# EAGLE design open-lux-O (EAGLE 6.5.0)
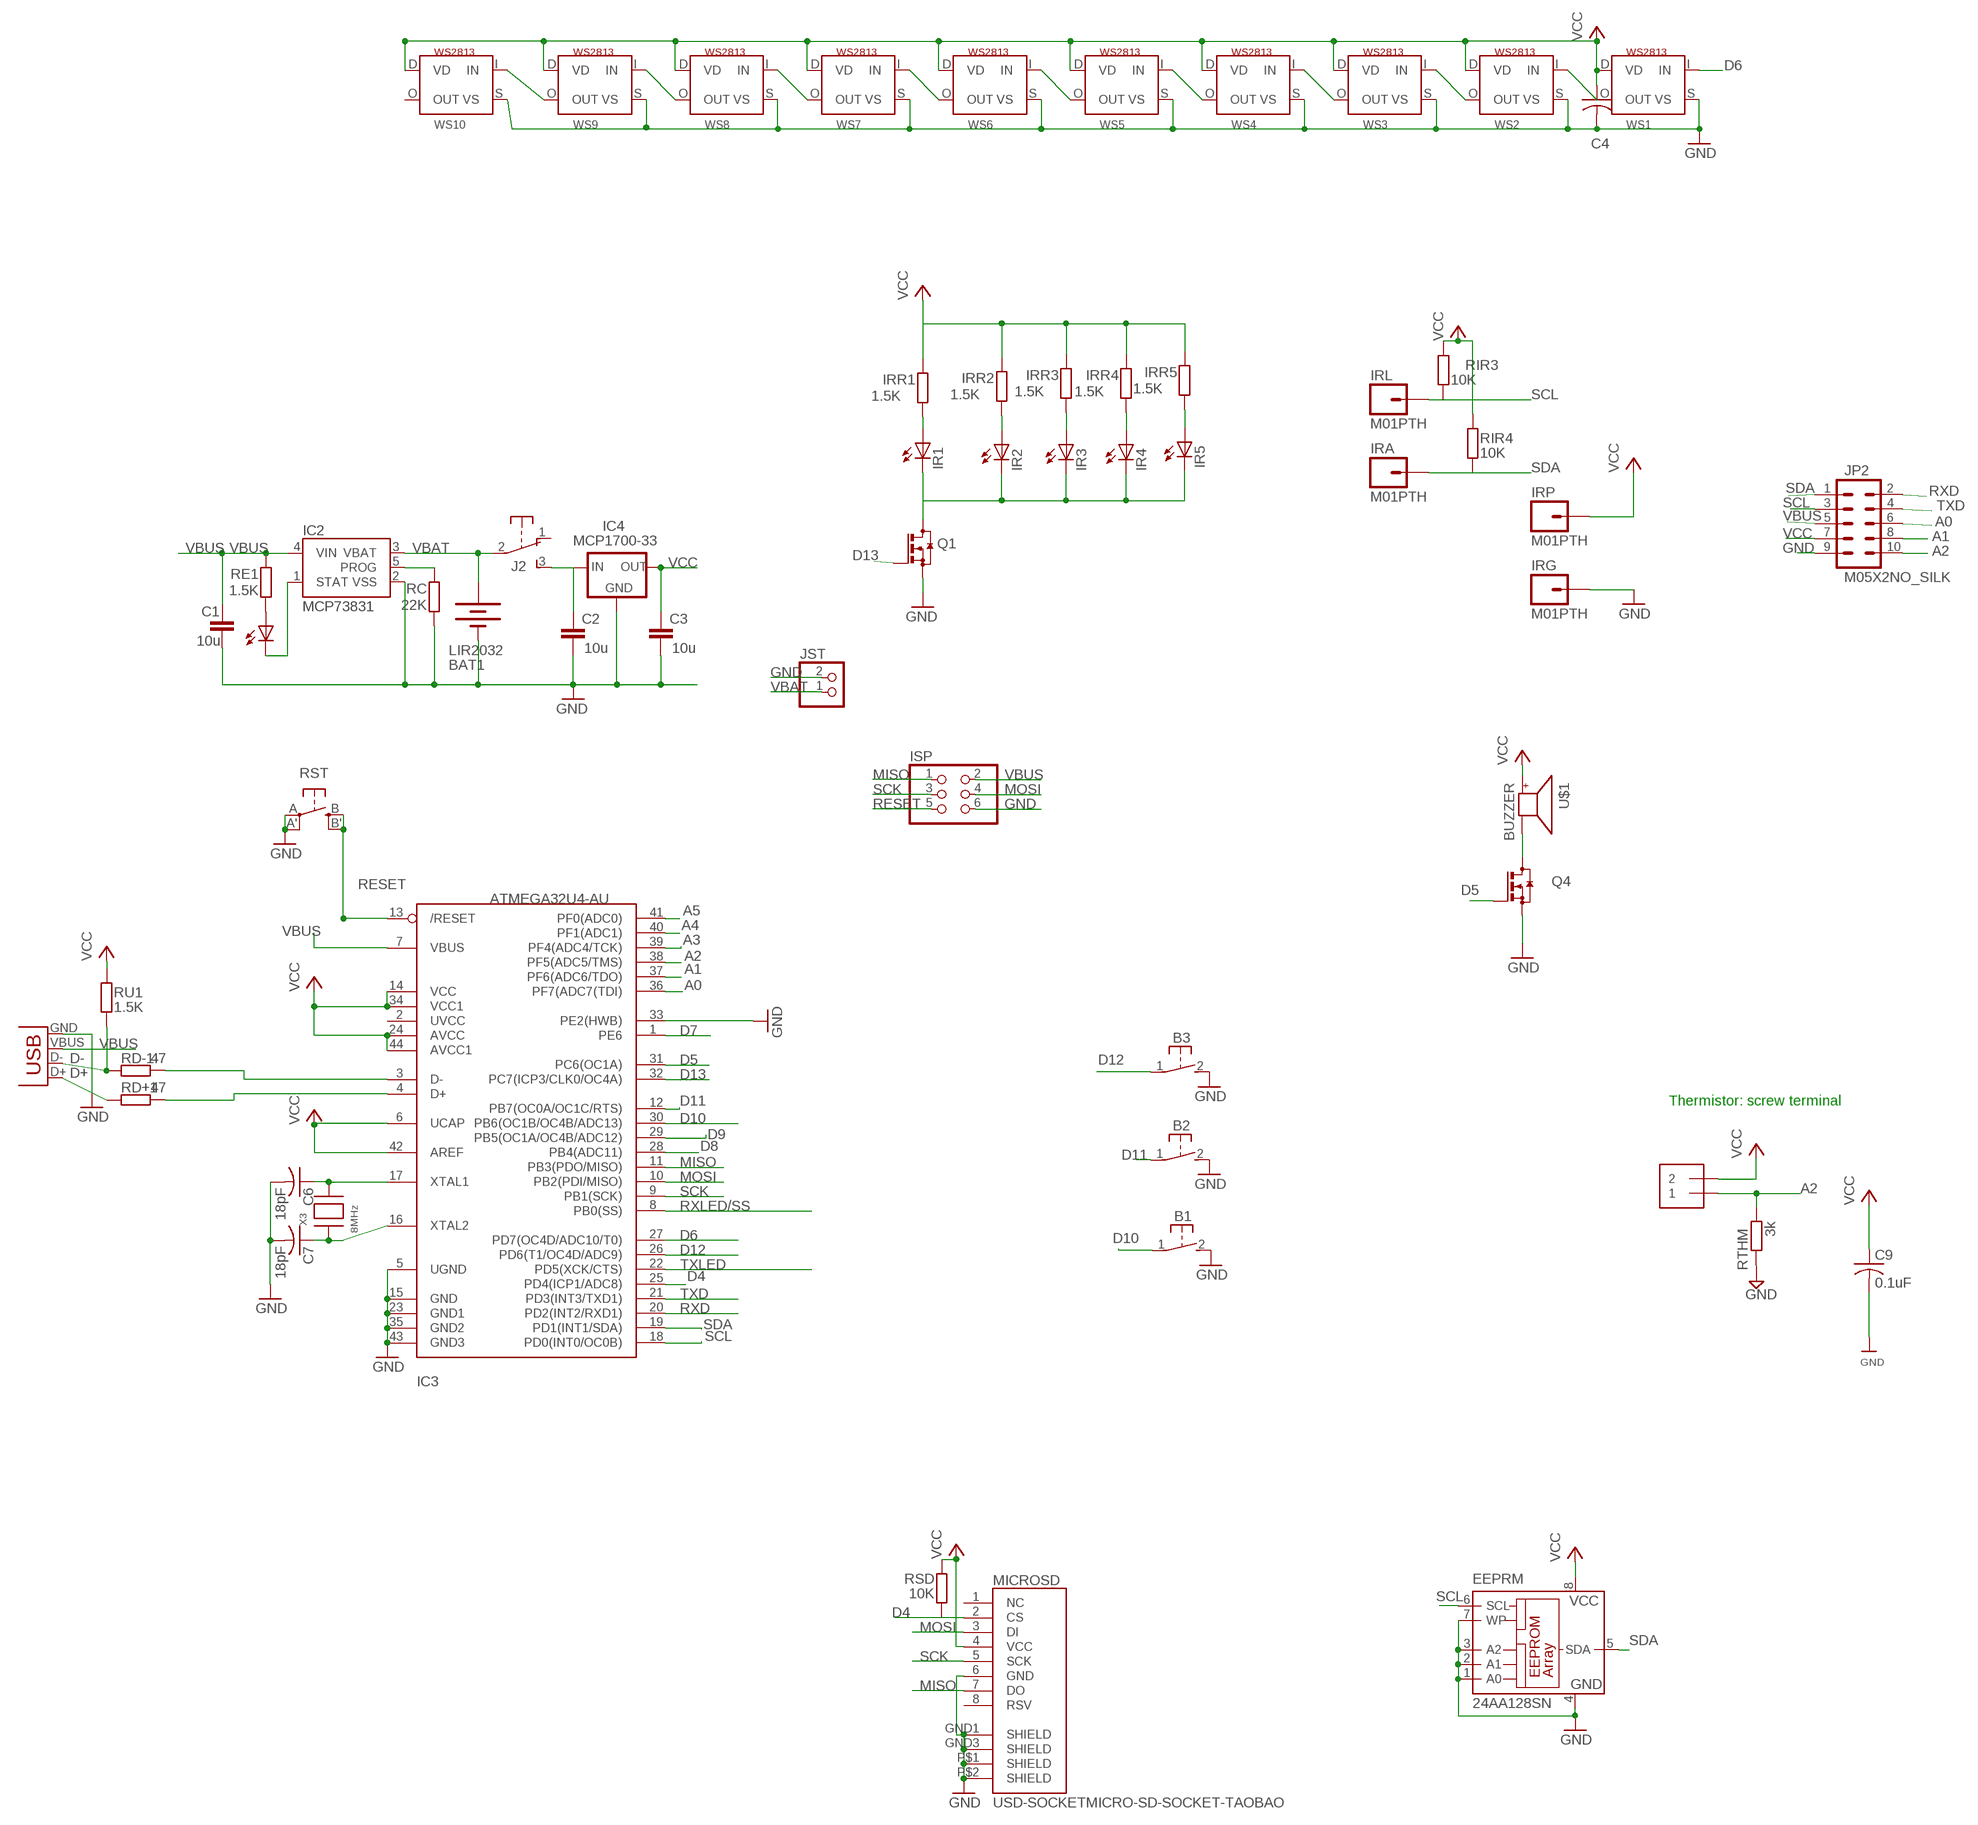
[diagram p0: schematic, sheet 1, part 1 of 2]
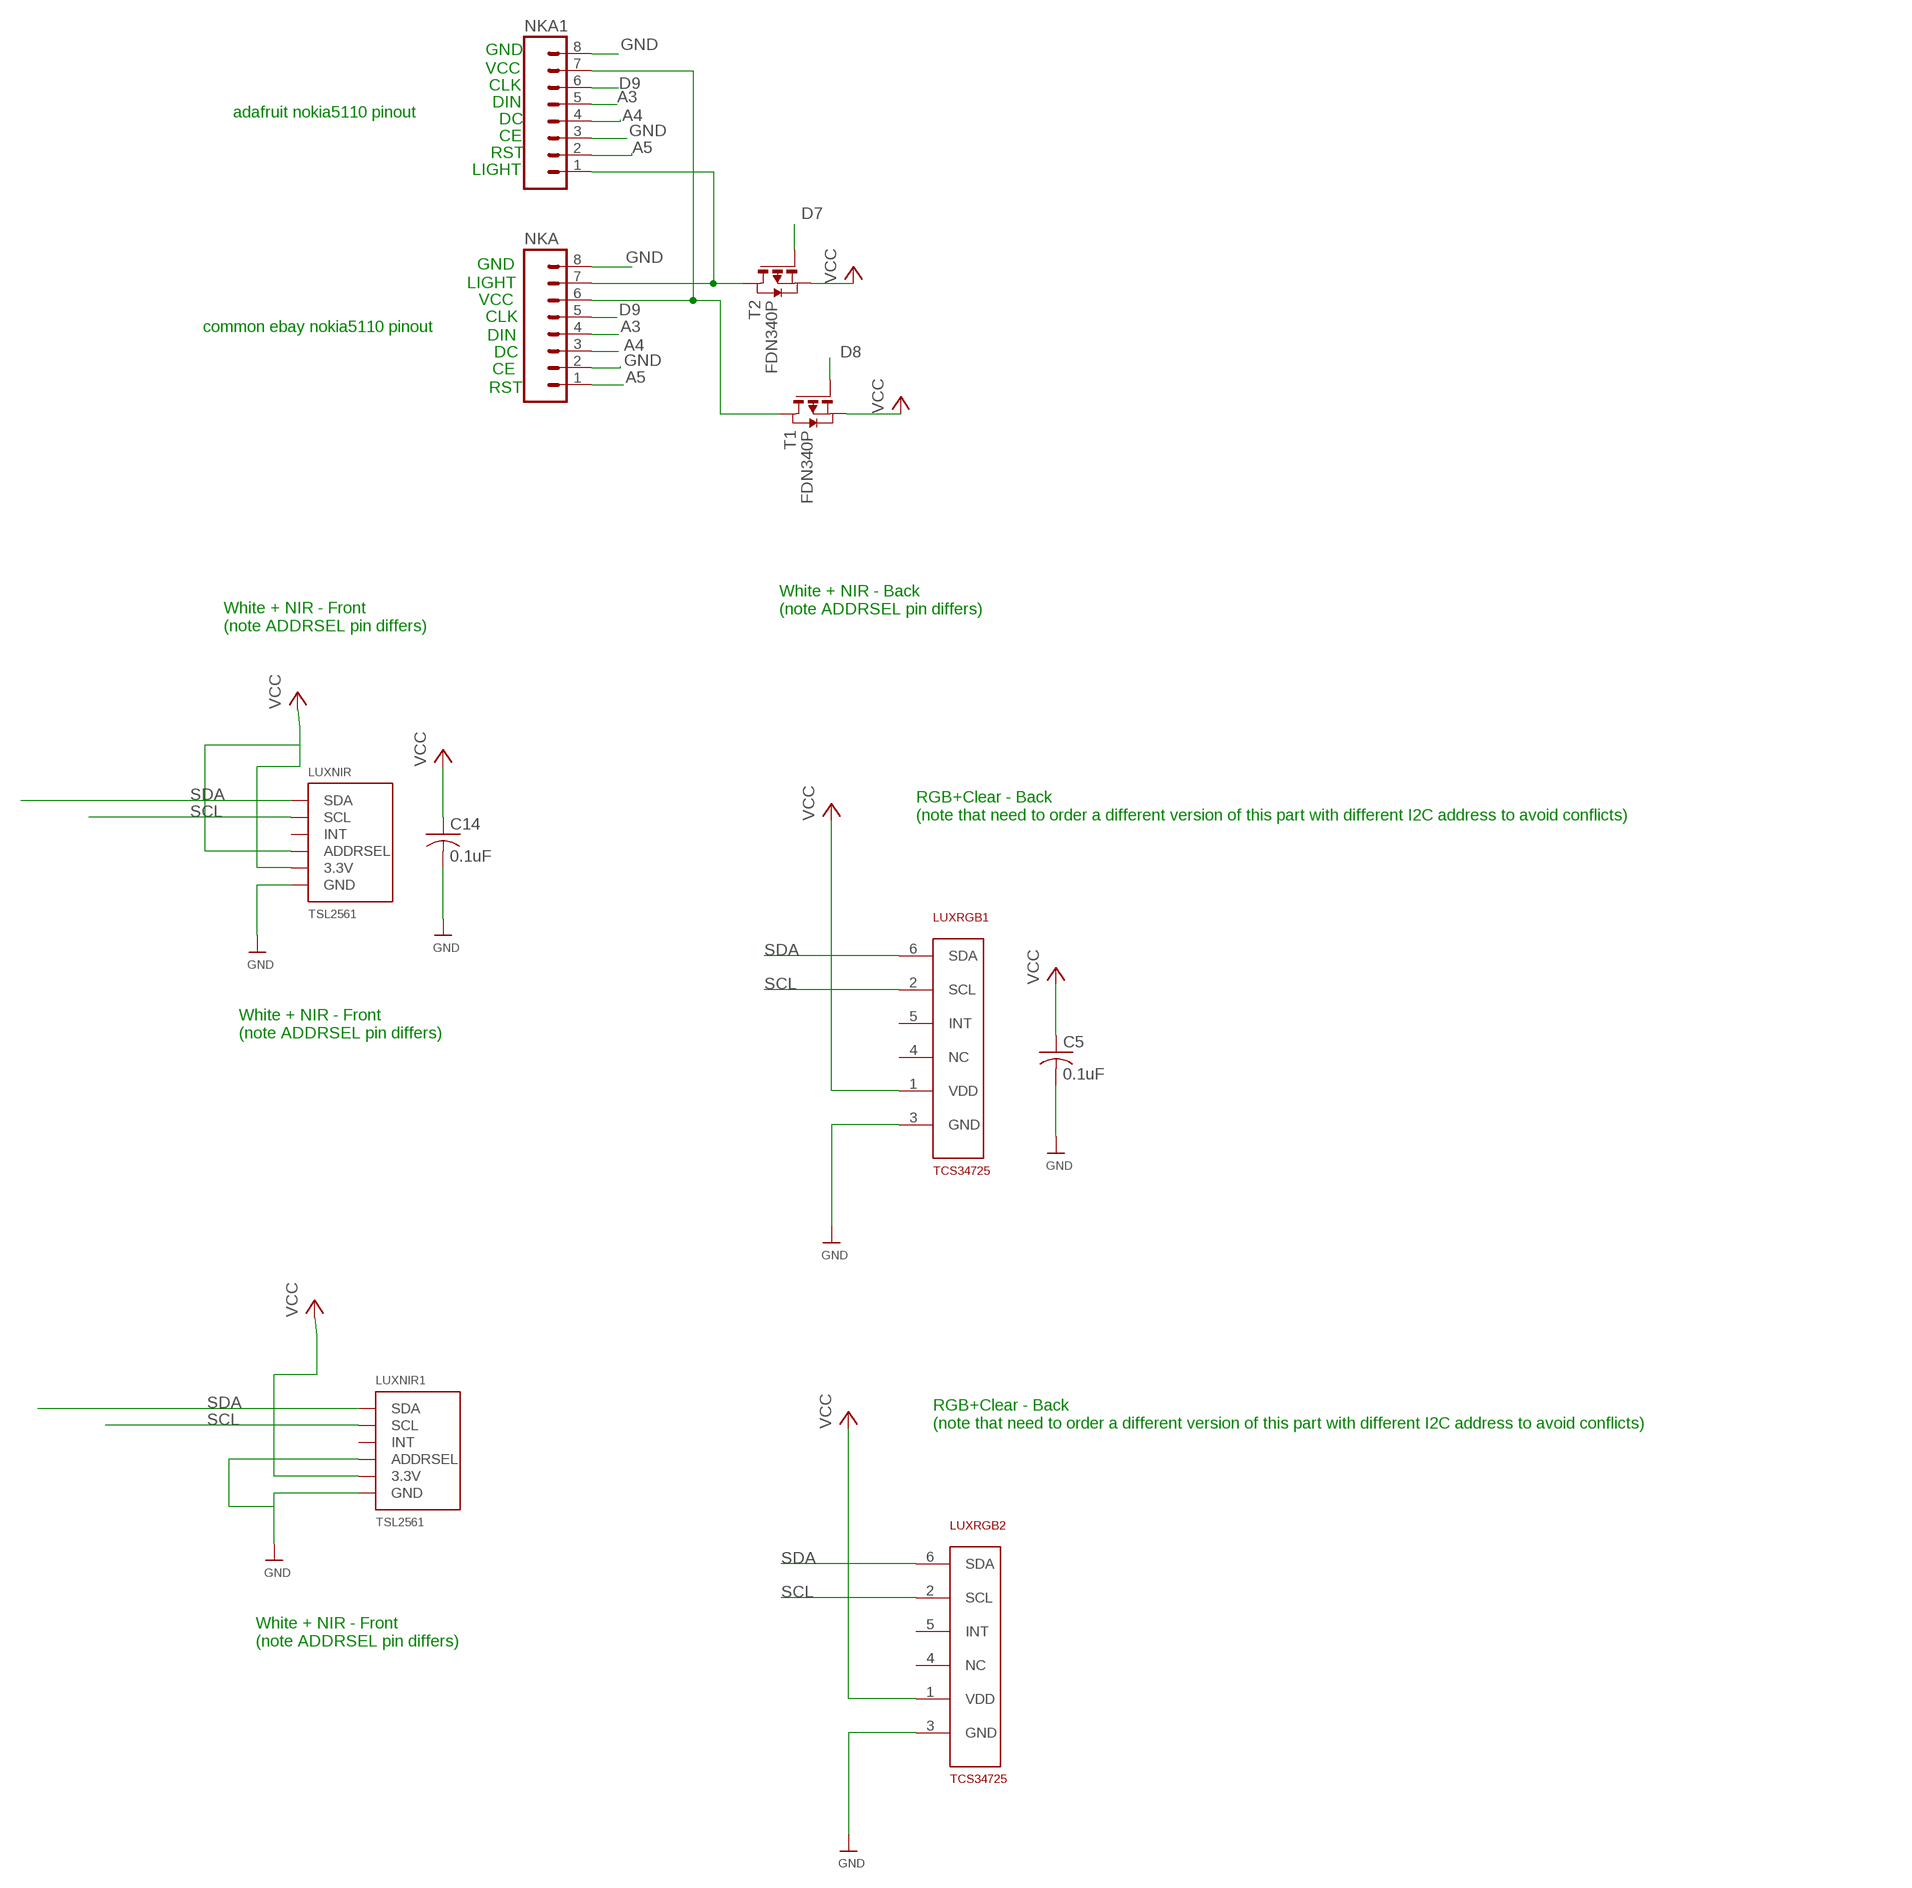
[diagram p1: schematic, sheet 1, part 2 of 2]

## Parts
B1  31-XX  [B3F-31XX]
B2  31-XX  [B3F-31XX]
B3  31-XX  [B3F-31XX]
BAT1  LIR2032  BATTERYBATTCOM_20MM_PTH_SMT  [BATTCOM_20MM_PTH_SMT]
C1  10u  C-EUC0805  [C0805]
C2  10u  C-EUC0805  [C0805]
C3  10u  C-EUC0805  [C0805]
C4  C-USC0805K  [C0805K]
C5  0.1uF  C-USC0805  [C0805]
C6  18pF  C-USC0805K  [C0805K]
C7  18pF  C-USC0805K  [C0805K]
C9  0.1uF  C-USC0805  [C0805]
C14  0.1uF  C-USC0805  [C0805]
CHARGE  0805  LEDCHIPLED_0805  [CHIPLED_0805]
EEPRM  24AA128SN  [SO-08]
IC2  MCP73831  [SOT23-5]
IC3  ATMEGA32U4-AU  [TQFP44]
IC4  MCP1700-33  MCP1700SOT233  [SOT23]
IR1  LEDCHIP-LED0603  [CHIP-LED0603]
IR2  LEDCHIP-LED0603  [CHIP-LED0603]
IR3  LEDCHIP-LED0603  [CHIP-LED0603]
IR4  LEDCHIP-LED0603  [CHIP-LED0603]
IR5  LEDCHIP-LED0603  [CHIP-LED0603]
IRA  M01PTH  [1X01]
IRG  M01PTH  [1X01]
IRL  M01PTH  [1X01]
IRP  M01PTH  [1X01]
IRR1  1.5K  R-EU_R0805  [R0805]
IRR2  1.5K  R-EU_R0805  [R0805]
IRR3  1.5K  R-EU_R0805  [R0805]
IRR4  1.5K  R-EU_R0805  [R0805]
IRR5  1.5K  R-EU_R0805  [R0805]
ISP  PINHD-2X3  [2X03]
J2  EG1206  [EG1206]
JP2  M05X2NO_SILK  [2X5_NOSILK]
JST  JST_2PIN-SMT-RA  [JST-PH-2-SMT-RA]
LUXNIR  TSL2561  [TSL2561_FN@1]
LUXNIR1  TSL2561  [TSL2561_FN@1]
LUXRGB1  TCS34725  [DFN-6]
LUXRGB2  TCS34725  [DFN-6]
MICROSD  USD-SOCKETMICRO-SD-SOCKET-TAOBAO  [MICRO-SD-SOCKET-TAOBAO]
NKA  M08LOCK  [1X08_LOCK]
NKA1  M08LOCK  [1X08_LOCK]
Q1  BSS123  [SOT23]
Q4  BSS123  [SOT23]
RC  22K  R-EU_R0805  [R0805]
RD+1  47  R-EU_R0805  [R0805]
RD-1  47  R-EU_R0805  [R0805]
RE1  1.5K  R-EU_R0805  [R0805]
RIR3  10K  R-EU_R0805  [R0805]
RIR4  10K  R-EU_R0805  [R0805]
RSD  10K  R-EU_R0805  [R0805]
RST  EVQQ2  [EVQ-Q2]
RTHM  3k  R-EU_0204/7  [0204/7]
RU1  1.5K  R-EU_R0805  [R0805]
T1  FDN340P  PMOSSOT23  [SOT-23]
T2  FDN340P  PMOSSOT23  [SOT-23]
THM1  1X2-3.5MM  [1X2-3.5MM]
U$1  BUZZER  [SMT-8585-BUZZER]
WS1  WS2813  [RGBLED5050_4]
WS2  WS2813  [RGBLED5050_4]
WS3  WS2813  [RGBLED5050_4]
WS4  WS2813  [RGBLED5050_4]
WS5  WS2813  [RGBLED5050_4]
WS6  WS2813  [RGBLED5050_4]
WS7  WS2813  [RGBLED5050_4]
WS8  WS2813  [RGBLED5050_4]
WS9  WS2813  [RGBLED5050_4]
WS10  WS2813  [RGBLED5050_4]
X2  USBSMD  [USB-MINIB]
X3  8MHz  XTALNX5032  [NX5032]

## Nets
A0: IC3.36(PF7(ADC7(TDI)) JP2.6
A1: IC3.37(PF6(ADC6/TDO)) JP2.8
A2: IC3.38(PF5(ADC5/TMS)) JP2.10 RTHM.2 THM1.1
A3: IC3.39(PF4(ADC4/TCK)) NKA1.5 NKA.4
A4: IC3.40(PF1(ADC1)) NKA1.4 NKA.3
A5: IC3.41(PF0(ADC0)) NKA1.2 NKA.1
D4: IC3.25(PD4(ICP1/ADC8)) MICROSD.2(CS) RSD.1
D5: IC3.31(PC6(OC1A)) Q4.1(G)
D6: IC3.27(PD7(OC4D/ADC10/T0)) WS1.I(IN)
D7: IC3.1(PE6) T2.3(G)
D8: IC3.28(PB4(ADC11)) T1.3(G)
D9: IC3.29(PB5(OC1A/OC4B/ADC12)) NKA1.6 NKA.5
D10: B1.1(P) IC3.30(PB6(OC1B/OC4B/ADC13))
D11: B2.1(P) IC3.12(PB7(OC0A/OC1C/RTS))
D12: B3.1(P) IC3.26(PD6(T1/OC4D/ADC9))
D13: IC3.32(PC7(ICP3/CLK0/OC4A)) Q1.1(G)
D+: RD+1.1 X2.D+
D-: RD-1.1 RU1.1 X2.D-
GND: B1.2(S) B2.2(S) B3.2(S) BAT1.P$1(-) C1.2 C2.2 C3.2 C4.2 C5.2 C6.2 C7.2 C9.2 C14.2 EEPRM.1(A0) EEPRM.2(A1) EEPRM.3(A2) EEPRM.4(GND) EEPRM.7(WP) IC2.2(VSS) IC3.5(UGND) IC3.15(GND) IC3.23(GND1) IC3.33(PE2(HWB)) IC3.35(GND2) IC3.43(GND3) IC4.1(GND) IRG.1 ISP.6 JP2.9 JST.2 LUXNIR1.ADR(ADDRSEL) LUXNIR1.VSS(GND) LUXNIR.VSS(GND) LUXRGB1.3(GND) LUXRGB2.3(GND) MICROSD.6(GND) MICROSD.GND1(SHIELD) MICROSD.GND3(SHIELD) MICROSD.P$1(SHIELD) MICROSD.P$2(SHIELD) NKA1.3 NKA1.8 NKA.2 NKA.8 Q1.2(S) Q4.2(S) RC.1 RST.A'(P1) RST.A(P) RTHM.1 WS1.S(VS) WS2.S(VS) WS3.S(VS) WS4.S(VS) WS5.S(VS) WS6.S(VS) WS7.S(VS) WS8.S(VS) WS9.S(VS) WS10.S(VS) X2.GND
MISO: IC3.11(PB3(PDO/MISO)) ISP.1 MICROSD.7(DO)
MOSI: IC3.10(PB2(PDI/MISO)) ISP.4 MICROSD.3(DI)
N$1: C2.1 IC4.3(IN) J2.3(S)
N$2: C7.1 IC3.16(XTAL2) X3.P$1
N$3: C6.1 IC3.17(XTAL1) X3.P$2
N$4: WS9.O(OUT) WS10.I(IN)
N$5: CHARGE.C IC2.1(STAT)
N$6: IC2.5(PROG) RC.2
N$7: Q4.3(D) U$1.-
N$9: IR1.C IR2.C IR3.C IR4.C IR5.C Q1.3(D)
N$10: CHARGE.A RE1.1
N$11: IR1.A IRR1.1
N$12: NKA1.1 NKA.7 T2.1(D)
N$13: IR2.A IRR2.1
N$14: WS6.O(OUT) WS7.I(IN)
N$15: IR3.A IRR3.1
N$17: IR4.A IRR4.1
N$18: IR5.A IRR5.1
N$19: WS4.O(OUT) WS5.I(IN)
N$20: WS5.O(OUT) WS6.I(IN)
N$21: IC3.4(D+) RD+1.2
N$22: IC3.3(D-) RD-1.2
N$23: WS1.O(OUT) WS2.I(IN)
N$24: WS2.O(OUT) WS3.I(IN)
N$25: WS3.O(OUT) WS4.I(IN)
N$27: WS8.O(OUT) WS9.I(IN)
N$28: WS7.O(OUT) WS8.I(IN)
N$31: NKA1.7 NKA.6 T1.1(D)
RESET: IC3.13(/RESET) ISP.5 RST.B'(S1) RST.B(S)
RXD: IC3.20(PD2(INT2/RXD1)) JP2.2
RXLED/SS: IC3.8(PB0(SS))
SCK: IC3.9(PB1(SCK)) ISP.3 MICROSD.5(SCK)
SCL: EEPRM.6(SCL) IC3.18(PD0(INT0/OC0B)) IRL.1 JP2.3 LUXNIR1.CLK(SCL) LUXNIR.CLK(SCL) LUXRGB1.2(SCL) LUXRGB2.2(SCL) RIR3.1
SDA: EEPRM.5(SDA) IC3.19(PD1(INT1/SDA)) IRA.1 JP2.1 LUXNIR1.DATA(SDA) LUXNIR.DATA(SDA) LUXRGB1.6(SDA) LUXRGB2.6(SDA) RIR4.1
TXD: IC3.21(PD3(INT3/TXD1)) JP2.4
TXLED: IC3.22(PD5(XCK/CTS))
VBAT: BAT1.P$2(+) IC2.3(VBAT) J2.2(P) JST.1
VBUS: C1.1 IC2.4(VIN) IC3.7(VBUS) ISP.2 JP2.5 RE1.2 X2.VBUS
VCC: C3.1 C4.1 C5.1 C9.1 C14.1 EEPRM.8(VCC) IC3.6(UCAP) IC3.14(VCC) IC3.24(AVCC) IC3.34(VCC1) IC3.42(AREF) IC3.44(AVCC1) IC4.2(OUT) IRP.1 IRR1.2 IRR2.2 IRR3.2 IRR4.2 IRR5.2 JP2.7 LUXNIR1.VDD(3.3V) LUXNIR.ADR(ADDRSEL) LUXNIR.VDD(3.3V) LUXRGB1.1(VDD) LUXRGB2.1(VDD) MICROSD.4(VCC) RIR3.2 RIR4.2 RSD.2 RU1.2 T1.2(S) T2.2(S) THM1.2 U$1.+ WS1.D(VD) WS2.D(VD) WS3.D(VD) WS4.D(VD) WS5.D(VD) WS6.D(VD) WS7.D(VD) WS8.D(VD) WS9.D(VD) WS10.D(VD)
Unconnected: IC3.2(UVCC) J2.1(O) LUXNIR1.INT LUXNIR.INT LUXRGB1.4(NC) LUXRGB1.5(INT) LUXRGB2.4(NC) LUXRGB2.5(INT) MICROSD.1(NC) MICROSD.8(RSV) WS10.O(OUT)

## Notes on the sheet
- GND
- VCC
- CLK
- adafruit nokia5110 pinout | DIN
- DC
- CE
- RST
- LIGHT
- GND
- LIGHT
- VCC
- common ebay nokia5110 pinout | CLK
- DIN
- DC
- CE
- RST
- White + NIR - Back
  (note ADDRSEL pin differs)
- White + NIR - Front
  (note ADDRSEL pin differs)
- RGB+Clear - Back 
  (note that need to order a different version of this part with different I2C address to avoid conflicts)
- White + NIR - Front
  (note ADDRSEL pin differs)
- Thermistor: screw terminal
- RGB+Clear - Back 
  (note that need to order a different version of this part with different I2C address to avoid conflicts)
- White + NIR - Front
  (note ADDRSEL pin differs)

## Library data of the parts
B1-B3 = adafruit:31-XX: OMRON SWITCH Now with beefier pads!
BAT1 = SparkFunNew:BATTERY: Battery Holders Various common sizes : AA, AAA, 20mm coin cell and 12mm coin cell.
C1-C3 = resistor:C-EU: CAPACITOR, European symbol
C4 = adafruit2013:C-US: CAPACITOR, American symbol
C5-C7 C9 C14 = adafruit:C-US: CAPACITOR, American symbol
CHARGE = led:LED: LED
EEPRM = microchip:24*: Serial EEPROM I2C; MF: MICROCHIP; MPN: 24AA128-I/SN; OC_FARNELL: unknown; OC_NEWARK: 92C6842
IC2 = SparkFunNew:MCP73831: Microchip's MCP73831 Miniature single cell, fully integrated Li-Ion, Li-polymer charge management controller http://ww1.microchip.com/downloads/en/DeviceDoc/21984a.pdf
IC3 = adaprog:ATMEGA32U4
IC4 = adafruit:MCP1700: VOLTAGE REGULATOR
IR1-IR5 = adafruit:LED: LED
IRA IRG IRL IRP = SparkFun-Connectors:M01: Header 1 Standard 1-pin 0.1" header. Use with straight break away headers (SKU : PRT-00116), right angle break away headers (PRT-00553), swiss pins (PRT-00743), machine pins (PRT-00117), and female headers (PRT-00115).
IRR1-IRR5 RC RD+1 RD-1 RE1 RIR3 RIR4 RSD RTHM RU1 = rcl:R-EU_: RESISTOR, European symbol
ISP = pinhead:PINHD-2X3: PIN HEADER
J2 = adafruit:EG1206
JP2 = SparkFun-Connectors:M05X2: Header 5x2 Standard 10-pin dual row 0.1" header. Commonly used with AVR-ISP. Use with Spark Fun Electronics SKU: PRT-00778
JST = adafruit:JST_2PIN: JST 2-Pin Connectors of various flavors SMT-RA (S2B-PH-SM4) 4UConnector #17311 SMT (B2B-PH-SM4) THM-RA (S2B-PH) THM (B2B-PH)
LUXNIR LUXNIR1 = microbuilder:TSL2561: TSL2561 Light-To-Digital Sensor Mouser Part Numbers: CS (obsolete): 856-TSL2561CS DFN (cheapest): 856-TSL2561FN
LUXRGB1 LUXRGB2 = dwbLibrary:TCS34725
MICROSD = SparkFunNew:USD-SOCKET: microSD Socket Push-push type uSD socket. Schematic element and footprint production proven. Spark Fun Electronics SKU : PRT-00127. tDoc lines correctly indicate media card edge positions when inserting (unlocked, locked, depressed).
NKA NKA1 = SparkFun-Connectors:M08: Header 8 Standard 8-pin 0.1" header. Use with straight break away headers (SKU : PRT-00116), right angle break away headers (PRT-00553), swiss pins (PRT-00743), machine pins (PRT-00117), and female headers (PRT-00115).
Q1 Q4 = transistor-small-signal:BSS123: N-CHANNEL MOS FET
RST = adafruit:EVQQ2: SMT 6mm switch, EVQQ2 series http://www.ladyada.net/library/eagle
T1 T2 = zetex:PMOSSOT23: MOS FET
THM1 = adafruit:1X2: 3.5mm Terminal block http://www.ladyada.net/library/pcb/eaglelibrary.html
U$1 = adafruit:BUZZER
WS1-WS10 = adafruit:WS2813
X2 = SparkFun:USB: USB Connectors USB-B-PTH is fully proven SKU : PRT-00139 USB-miniB is fully proven SKU : PRT-00587 USB-A-PCB is untested. USB-A-H is throughly reviewed, but untested. Spark Fun Electronics SKU : PRT-00437 USB-B-SMT is throughly reviewed, but untested. Needs silkscreen touching up. USB-A-S has not been used/tested USB-MB-H has not been used/tested
X3 = adaprog:XTAL

## Net classes
1 power: width 0.813 mm, clearance 0.203 mm

## Board
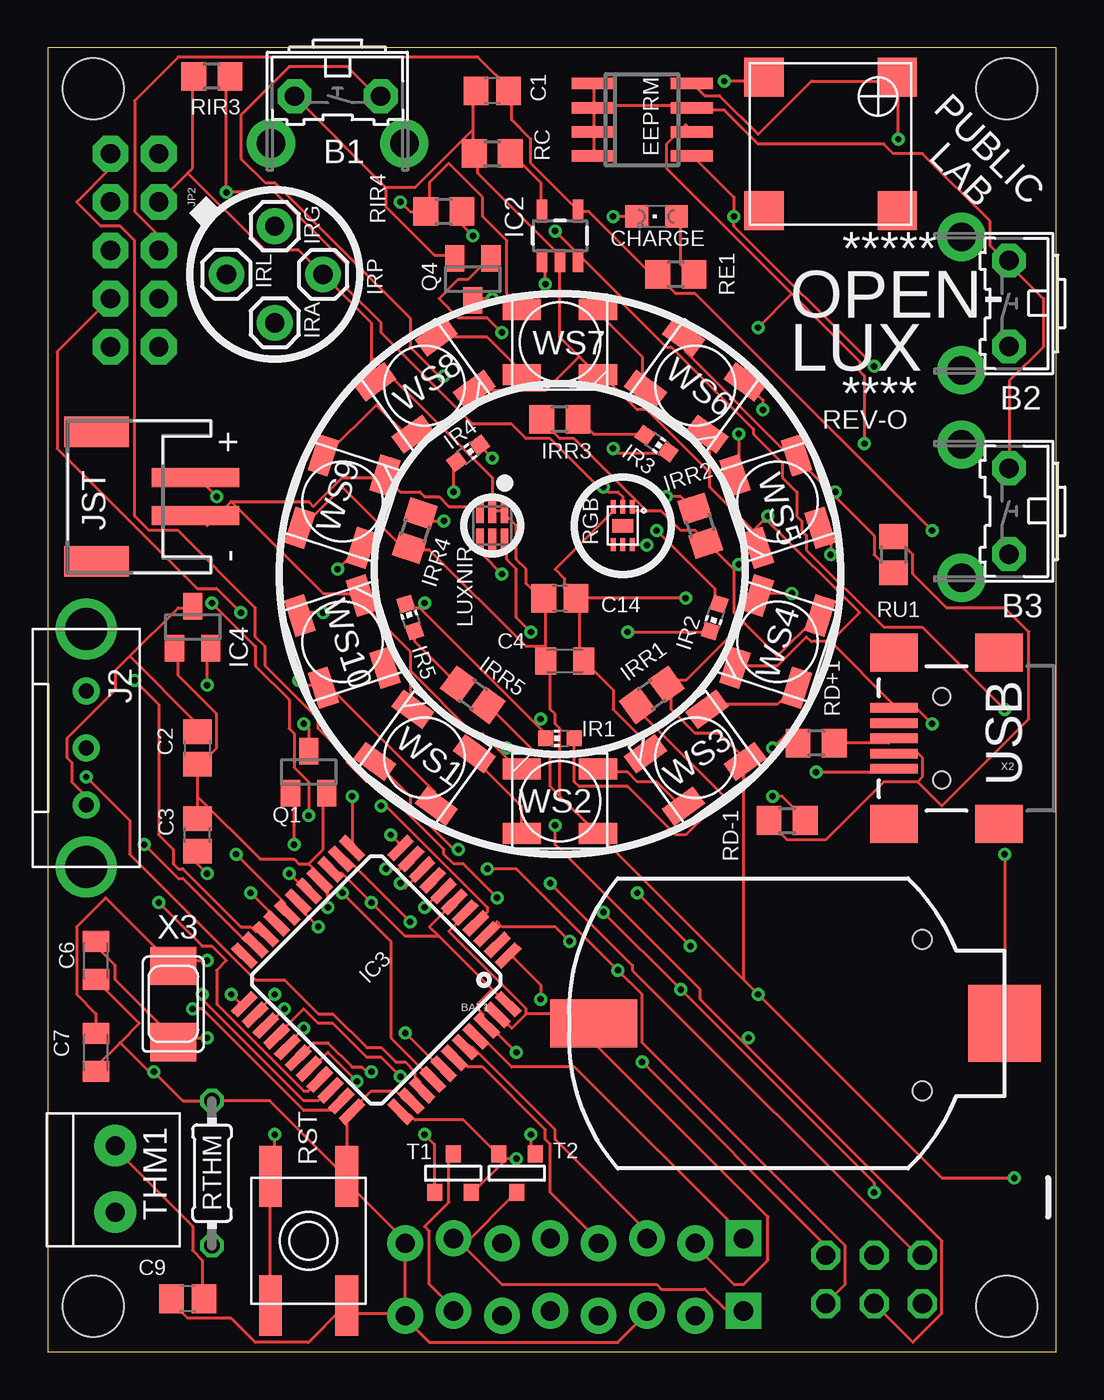
[diagram p2: board, top side]
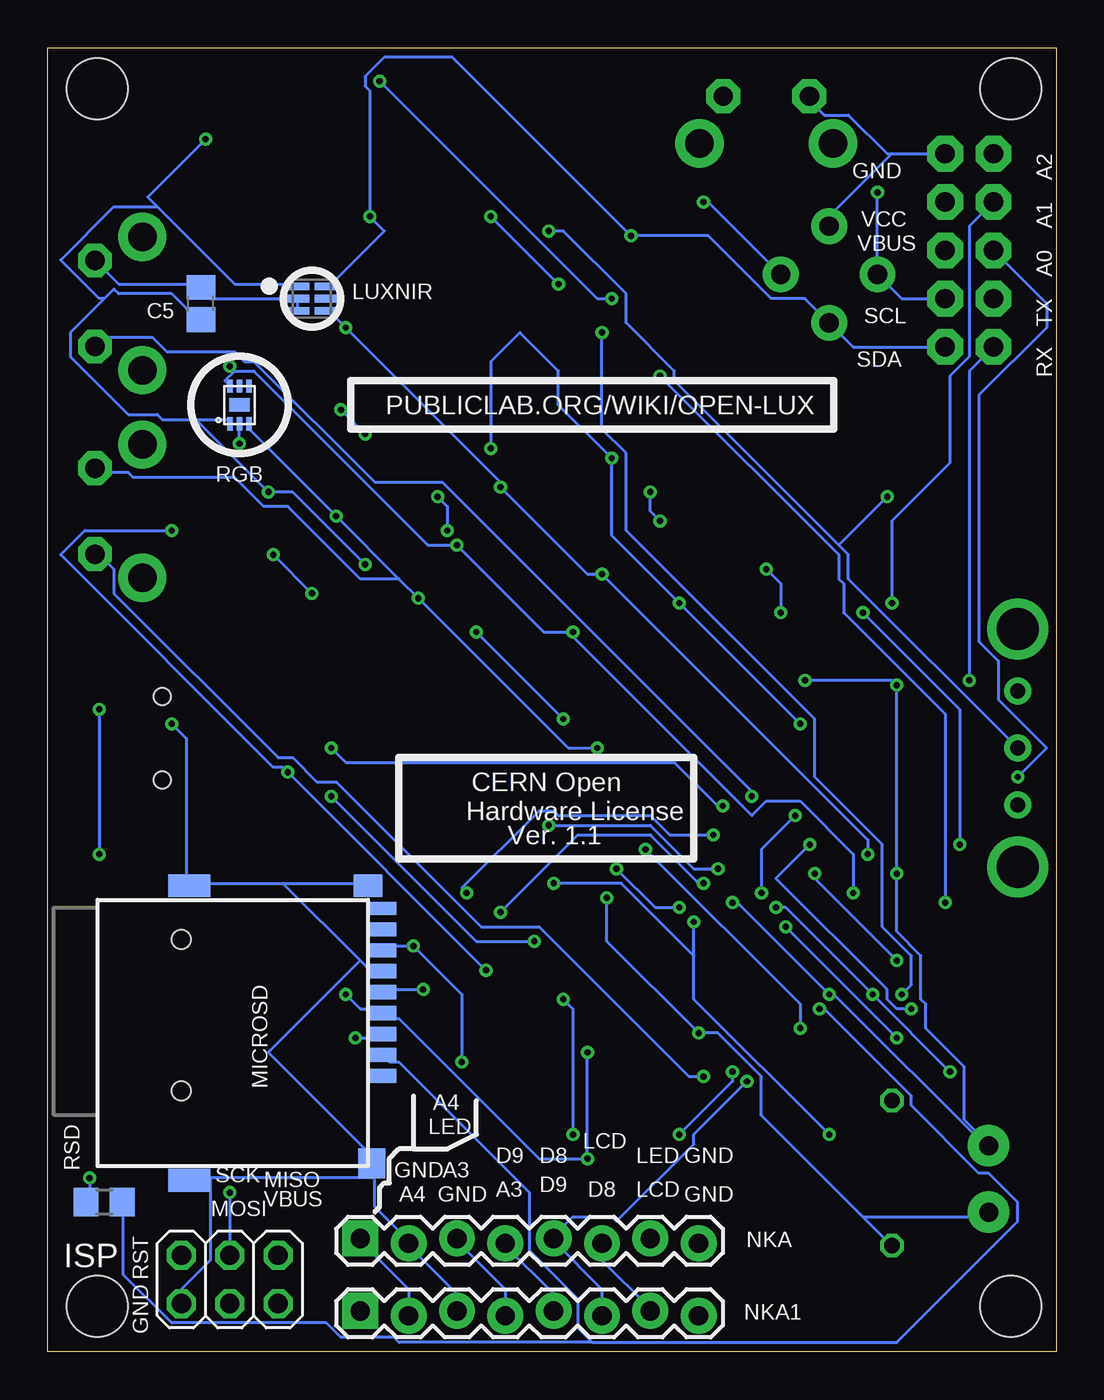
[diagram p3: board, bottom side, seen from below]

Size 53.01 x 68.57 mm. Coordinates in mm from the lower left corner, seen from the top.
Outline: 0,0 53.01,0 53.01,68.57 0,68.57 0,0
Copper layers (1*16): Top 0.0356mm / dielectric 1.5011mm / Bottom 0.0356mm
Design rules "LaenPCBOrder": minimum track width 6mil, minimum drill 13mil, track to track 6mil, track to pad 6mil, pad to pad 6mil, via to via 6mil, smd to smd 6mil, copper to edge 15mil, drill to drill 6mil, minimum pad ring 7mil, minimum via ring 7mil, stop-mask expansion 3mil, vias tented up to drill 0mil, thermal gap 10mil
Holes 3.2 mm at 2.4,66.4 50.4,2.4 50.4,66.4 2.4,2.4

### Footprints (pad centres in the part's own frame; a part is rotated, then mirrored left to right if it is on the bottom)
B3F-31XX = drill 1.016 pad 1.778 octagon: 1 -2.261,-1.245; 2 2.261,-1.245 | drill 1.499 pad 2.54: 3 -3.505,1.245; 4 3.505,1.245
BATTCOM_20MM_PTH_SMT = smd 4.572 x 2.54: P$1 0,0 | smd 3.81 x 4.064: P$2 21.59,0
C0805 = smd 1.3 x 1.5: 1 -0.85,0; 2 0.85,0
C0805K = smd 1.1 x 1.4: 1 -1,0; 2 1,0
CHIPLED_0805 = smd 1.2 x 1.2: A 0,-1.05; C 0,1.05
SO-08 = smd 0.6 x 2.2: 1 -1.905,-2.6; 2 -0.635,-2.6; 3 0.635,-2.6; 4 1.905,-2.6; 5 1.905,2.6; 6 0.635,2.6; 7 -0.635,2.6; 8 -1.905,2.6
SOT23-5 = smd 0.55 x 1.2: 1 -0.95,-1.3; 2 0,-1.3; 3 0.95,-1.3; 4 0.95,1.3; 5 -0.95,1.3
TQFP44 = smd 1.5 x 0.5: 1 -5.8,4; 2 -5.8,3.2; 3 -5.8,2.4; 4 -5.8,1.6; 5 -5.8,0.8; 6 -5.8,0; 7 -5.8,-0.8; 8 -5.8,-1.6; 9 -5.8,-2.4; 10 -5.8,-3.2; 11 -5.8,-4; 23 5.8,-4; 24 5.8,-3.2; 25 5.8,-2.4; 26 5.8,-1.6; 27 5.8,-0.8; 28 5.8,0; 29 5.8,0.8; 30 5.8,1.6; 31 5.8,2.4; 32 5.8,3.2; 33 5.8,4 | smd 0.5 x 1.5: 12 -4,-5.8; 13 -3.2,-5.8; 14 -2.4,-5.8; 15 -1.6,-5.8; 16 -0.8,-5.8; 17 0,-5.8; 18 0.8,-5.8; 19 1.6,-5.8; 20 2.4,-5.8; 21 3.2,-5.8; 22 4,-5.8; 34 4,5.8; 35 3.2,5.8; 36 2.4,5.8; 37 1.6,5.8; 38 0.8,5.8; 39 0,5.8; 40 -0.8,5.8; 41 -1.6,5.8; 42 -2.4,5.8; 43 -3.2,5.8; 44 -4,5.8
SOT23 = smd 1 x 1.4: 1 -0.95,-1.1; 2 0.95,-1.1; 3 0,1.1
CHIP-LED0603 = smd 0.8 x 0.8: A 0,-0.75; C 0,0.75
1X01 = drill 1.016 pad 1.88: 1 0,0
R0805 = smd 1.3 x 1.5: 1 -0.95,0; 2 0.95,0
2X03 = drill 1.016 octagon: 1 -2.54,-1.27; 2 -2.54,1.27; 3 0,-1.27; 4 0,1.27; 5 2.54,-1.27; 6 2.54,1.27
EG1206 = drill 0.8 pad 1.422: 1 -3,0; 2 0,0; 3 3,0 | drill 2.2: MT1 -6.25,0; MT2 6.25,0
2X5_NOSILK = drill 1.016 pad 1.88 octagon: 1 -1.27,5.08; 2 1.27,5.08; 3 -1.27,2.54; 4 1.27,2.54; 5 -1.27,0; 6 1.27,0; 7 -1.27,-2.54; 8 1.27,-2.54; 9 -1.27,-5.08; 10 1.27,-5.08
JST-PH-2-SMT-RA = smd 1 x 4.6: 1 1,-3.7; 2 -1,-3.7 | smd 1.6 x 3.4: NC1 -3.4,1.5; NC2 3.4,1.5
TSL2561_FN@1 = smd 1.3 x 0.4: ADR -0.8,0; CLK 0.8,-0.65; DATA 0.8,0.65; INT 0.8,0; VDD -0.8,0.65; VSS -0.8,-0.65
DFN-6 = smd 0.28 x 0.7: 1 -0.5,-0.988; 2 0,-0.988; 3 0.5,-0.988; 4 0.5,0.988; 5 0,0.988; 6 -0.5,0.988 | smd 1.1 x 0.7: P$1 0,0
MICRO-SD-SOCKET-TAOBAO = smd 0.75 x 1.6: 1 2.25,10.5; 2 1.15,10.5; 3 0.05,10.5; 4 -1.05,10.5; 5 -2.15,10.5; 6 -3.25,10.5; 7 -4.35,10.5; 8 -5.45,10.5 | smd 0.7 x 1.6: CD -6.55,10.5 | smd 1.2 x 1.5: GND1 -7.75,9.8 | smd 1.6 x 1.4: GND3 6.85,10 | smd 1.2 x 2.2: P$1 7.75,0.4; P$2 -7.75,0.4 | hole 1: 3.05,0; -4.93,0
1X08_LOCK = drill 1.016 pad 1.88 square: 1 0,0.127 | drill 1.016 pad 1.88: 2 2.54,-0.127; 3 5.08,0.127; 4 7.62,-0.127; 5 10.16,0.127; 6 12.7,-0.127; 7 15.24,0.127; 8 17.78,-0.127
EVQ-Q2 = smd 3.2 x 1.2: A -3.4,-2; A' 3.4,-2; B -3.4,2; B' 3.4,2
0204/7 = drill 0.813 octagon: 1 -3.81,0; 2 3.81,0
SOT-23 = smd 0.787 x 0.889: 1 0.025,-1.016; 2 -0.94,1.016; 3 0.991,1.016
1X2-3.5MM = drill 1 pad 2.184: 1 1.8,0; 2 -1.7,0
SMT-8585-BUZZER = smd 2.05 x 2.05: + -3.5,-3.5; - 3.5,-3.5; NC1 -3.5,3.5; NC2 3.5,3.5
RGBLED5050_4 = smd 2 x 1.1: D -2,1.7; I 2,1.7; O -2,-1.7; S 2,-1.7
USB-MINIB = smd 2.5 x 0.5: D+ 2.5,0; D- 2.5,0.8; GND 2.5,-1.6; ID 2.5,-0.8; VBUS 2.5,1.6 | smd 2.5 x 2: GND@1 -3,-4.5; GND@2 -3,4.5; GND@3 2.5,4.5; GND@4 2.5,-4.5 | hole 0.9: 0,2.2; 0,-2.2
NX5032 = smd 2 x 2.4: P$1 2,0; P$2 -2,0

### Placement (x,y rotation side)
B1  15.24,64.77 180 top
B2  49.28,55.12 90 top
B3  49.28,44.2 90 top
BAT1  28.7,17.27 0 top
C1  23.37,66.29 180 top
C2  7.87,31.75 270 top
C3  7.87,27.18 90 top
C4  27.18,36.32 0 top
C5  44.96,55.12 90 bottom
C6  2.54,20.57 270 top
C7  2.54,15.75 270 top
C9  7.37,2.79 180 top
C14  26.92,39.62 0 top
CHARGE  32,59.69 90 top
EEPRM  31.24,64.77 270 top
IC2  26.92,58.67 0 top
IC3  17.27,19.56 225 top
IC4  7.62,38.1 0 top
IR1  26.92,32.26 90 top
IR2  35.05,38.61 162 top
IR3  32,47.75 234 top
IR4  22.1,47.24 306 top
IR5  19.05,38.61 18 top
IRA  11.94,54.1 180 top
IRG  11.94,59.18 180 top
IRL  9.4,56.64 180 top
IRP  14.48,56.64 180 top
IRR1  31.75,34.54 36 top
IRR2  34.29,43.43 288 top
IRR3  26.92,49.02 180 top
IRR4  19.3,43.18 252 top
IRR5  22.35,34.54 324 top
ISP  43.43,3.81 180 bottom
J2  2.03,31.75 270 top
JP2  4.57,57.91 180 top
JST  4.06,44.96 90 top
LUXNIR  23.37,43.43 270 top
LUXNIR1  39.12,55.37 0 bottom
LUXRGB1  30.23,43.43 180 top
LUXRGB2  42.93,49.78 0 bottom
MICROSD  45.97,16.76 270 bottom
NKA  36.58,5.84 0 bottom
NKA1  36.58,2.03 0 bottom
Q1  13.72,30.48 0 top
Q4  22.35,56.39 180 top
RC  23.37,62.99 0 top
RD+1  40.39,32 180 top
RD-1  38.86,27.94 0 top
RE1  33.02,56.64 180 top
RIR3  8.64,67.06 180 top
RIR4  20.83,59.94 180 top
RSD  50.04,7.87 180 bottom
RST  13.72,5.84 90 top
RTHM  8.64,9.4 270 top
RU1  44.45,41.91 270 top
T1  21.34,9.4 180 top
T2  24.64,9.4 0 top
THM1  3.56,9.14 270 top
U$1  41.15,63.5 180 top
WS1  19.81,31.24 144 top
WS2  26.92,28.96 180 top
WS3  34.04,31.24 216 top
WS4  38.35,37.34 252 top
WS5  38.35,44.7 288 top
WS6  34.04,50.8 324 top
WS7  26.92,53.09 0 top
WS8  19.81,50.8 36 top
WS9  15.49,44.7 72 top
WS10  15.49,37.34 108 top
X2  46.99,32.26 180 top
X3  6.6,18.29 90 top

### Tracks (layer width: path | path; a pad name or v marks a point on that pad's centre or on a via)
A0  (via drill 0.33)
  Top 0.152: v2.03,30.23 4.32,27.94 4.32,26.16 10.92,19.56 12.45,19.56 14.22,17.78 14.99,17.78 16.76,16 17.53,16 18.29,15.24 18.8,15.24 19.3,14.73 19.3,14.48 19.56,14.22 19.56,13.97 IC3.36
  Bottom 0.152: v2.03,30.23 0.51,31.75 3.05,34.29 3.05,36.32 4.06,37.34 4.06,50.29 0.51,53.85 0.51,55.12 JP2.6
A1  (via drill 0.33)
  Top 0.152: v15.49,24.13 18.03,21.59 18.03,16.51 20.07,14.48 IC3.37 | v13.72,28.19 13.72,29.97 12.95,30.73 12.95,32.51 12.7,32.77 12.7,34.29 10.92,36.07 10.92,37.08 v8.64,39.37
  Bottom 0.152: v15.49,24.13 15.49,26.42 v13.72,28.19 | v8.64,39.37 8.64,43.69 5.59,46.74 5.59,51.31 4.57,52.32 4.57,59.18 JP2.8
A2  (via drill 0.33)
  Top 0.152: v18.8,16.76 20.57,14.99 IC3.38 | JP2.10 3.3,62.23 1.52,60.45 2.79,59.18 3.81,59.18 4.57,58.42 4.57,43.94 5.33,43.18 6.86,43.18 10.92,39.12 10.92,37.59 11.43,37.08 11.43,36.07 14.22,33.27 14.22,32.77 15.75,31.24 15.75,30.99 16.76,29.97 17.27,29.97 20.83,26.42 20.83,26.16 21.34,25.65 21.84,25.65 v23.62,23.88
  Bottom 0.152: RTHM.2 10.16,7.11 | 10.16,7.11 15.49,12.45 15.49,14.48 17.78,16.76 v18.8,16.76 23.62,21.59 v23.62,23.88 | 10.16,7.11 3.56,7.11 THM1.1
A3
  Top 0.152: IC3.39 21.59,15.24 21.84,15.24 22.1,14.99 22.86,14.99 26.16,11.68 26.16,11.18 26.42,10.92 26.42,8.38 28.96,5.84 NKA.4
  Bottom 0.152: NKA1.5 26.42,3.05 28.96,5.59 NKA.4
A4
  Top 0.152: NKA.3 31.5,6.35 26.67,11.18 26.67,11.68 22.35,16 22.1,16 IC3.40
  Bottom 0.152: NKA1.4 28.96,3.3 31.5,5.84 NKA.3
A5
  Top 0.152: IC3.41 22.61,16.51 22.86,16.51 24.38,14.99 27.69,14.99 36.58,6.1 NKA.1
  Bottom 0.152: NKA1.2 34.04,3.3 36.58,5.84 NKA.1
D4  (via drill 0.33)
  Top 0.152: v12.45,18.03 11.68,17.27 IC3.25
  Bottom 0.152: v12.45,18.03 12.19,18.03 7.62,13.46 7.62,12.95 4.06,9.4 3.56,9.4 2.03,7.87 2.03,6.86 8.38,0.51 24.38,0.51 | 24.38,0.51 25.15,1.27 25.15,2.79 27.69,5.33 27.69,8.38 34.54,15.24 35.05,15.24 35.31,15.49 MICROSD.2 | 24.38,0.51 34.54,0.51 34.8,0.76 37.59,0.76 38.35,1.52 46.48,1.52 49.02,4.06 49.02,7.87 RSD.1
D5  (via drill 0.33)
  Top 0.152: v23.88,53.59 23.11,54.36 21.59,54.36 20.57,55.37 21.59,56.39 22.1,56.39 23.11,57.4 Q4.1 | v8.13,18.8 8.13,18.54 13.46,13.21 14.22,13.21 14.73,13.72 IC3.31
  Bottom 0.152: v23.88,53.59 23.88,48.51 22.61,47.24 22.61,43.18 12.7,33.27 12.7,30.23 9.14,26.67 9.14,22.35 7.62,20.83 7.62,19.3 v8.13,18.8
D6  (via drill 0.33)
  Top 0.152: v13.46,17.02 12.7,16.26 IC3.27 | v21.59,26.42 21.34,26.42 19.05,28.7 19.05,29.21 17.27,30.99 WS1.I
  Bottom 0.152: v13.46,17.02 13.46,18.29 v21.59,26.42
D7  (via drill 0.33)
  Top 0.152: v25.4,11.43 25.4,10.41 T2.3 | v25.91,18.54 25.91,19.3 24.38,20.83 IC3.1
  Bottom 0.152: v25.4,11.43 25.4,18.03 v25.91,18.54
D8  (via drill 0.33)
  Top 0.152: v19.81,11.43 20.32,10.92 20.32,8.38 T1.3 | v17.02,14.73 16.76,14.73 16.51,14.99 16,14.99 14.73,16.26 13.97,16.26 IC3.28
  Bottom 0.152: v19.81,11.43 17.02,14.22 v17.02,14.73
D9  (via drill 0.33)
  Top 0.152: v16.26,14.22 14.73,15.75 13.97,14.99 IC3.29
  Bottom 0.152: v16.26,14.22 19.05,11.43 19.05,10.92 23.11,6.86 23.37,7.11 25.4,7.11 26.42,6.1 NKA.5 26.42,5.84 23.88,3.3 NKA1.6
D10  (via drill 0.33)
  Top 0.152: v5.84,23.62 8.13,21.34 8.64,21.34 9.4,20.57 8.89,20.07 8.89,18.29 13.46,13.72 13.72,13.72 14.22,14.22 IC3.30 | v20.83,51.31 20.57,51.31 19.05,52.83 19.05,54.36 11.94,61.47 11.43,61.47 10.16,62.74 10.16,65.02 12.7,67.56 15.75,67.56 17.27,66.04 B1.1
  Bottom 0.152: v5.84,23.62 5.84,33.53 11.18,38.86 11.18,40.39 11.43,40.64 11.43,41.91 v20.83,51.31
D11  (via drill 0.33)
  Top 0.152: v16,29.21 16,26.67 IC3.12
  Bottom 0.152: v16,29.21 16,29.46 32.26,45.72 35.81,45.72 42.16,52.07 42.67,52.07 43.18,52.58 46.74,52.58 47.5,53.34 50.04,53.34 B2.1
D12  (via drill 0.33)
  Top 0.152: v18.54,14.48 17.53,15.49 16.76,15.49 14.99,17.27 14.22,17.27 13.46,18.03 12.19,16.76 IC3.26
  Bottom 0.152: v18.54,14.48 19.3,14.48 27.18,22.35 30.23,22.35 37.85,29.97 38.86,29.97 40.13,31.24 40.89,31.24 49.53,39.88 49.53,41.15 50.29,41.91 B3.1
D13  (via drill 0.33)
  Top 0.152: v12.95,26.67 12.95,29.21 Q1.1 | v7.62,18.03 8.13,18.03 13.46,12.7 14.99,12.7 15.24,12.95 IC3.32
  Bottom 0.152: v12.95,26.67 14.73,24.89 8.89,19.05 8.89,18.54 8.38,18.03 v7.62,18.03
D+
  Top 0.152: RD+1.1 44.2,32 44.45,32.26 X2.D+
D-
  Top 0.152: 45.72,29.97 43.94,29.97 40.89,26.92 38.86,26.92 38.1,27.69 38.1,27.94 RD-1.1 | 45.72,29.97 45.97,30.23 45.97,31.24 45.72,31.5 44.7,31.5 X2.D- | 45.72,29.97 46.99,28.7 51.56,33.27 51.56,37.85 50.29,39.12 47.24,39.12 45.47,40.89 45.47,41.91 44.7,42.67 44.45,42.67 RU1.1
GND  (via drill 0.33)
  Top 0.152: 25.15,17.78 25.15,18.03 21.08,22.1 21.84,22.86 IC3.5 | 25.15,17.78 24.38,17.02 23.88,17.53 IC3.43 | 25.15,17.78 28.19,17.78 BAT1.P$1 28.7,16.26 37.85,7.11 37.85,4.83 36.58,3.56 36.07,3.56 34.04,5.59 NKA.2 | 13.72,25.65 14.48,26.42 14.48,29.21 Q1.2 | 13.72,25.65 14.48,24.89 IC3.15 14.48,24.64 14.48,24.38 14.73,24.13 v14.73,23.37 | 7.87,30.73 8.89,31.75 8.89,33.53 6.86,35.56 6.86,36.83 IC4.1 | 7.87,30.73 7.87,29.21 | 7.87,29.21 C3.2 | 7.87,30.73 C2.2 | 13.72,25.65 13.21,25.65 12.95,25.91 11.18,25.91 7.87,29.21 | 3.81,16.26 4.83,17.27 2.54,19.56 C6.2 | 3.81,16.26 2.54,14.99 C7.2 | v9.65,18.8 10.16,18.29 IC3.23 | 3.81,16.26 5.33,14.73 v5.59,14.73 7.11,13.21 RTHM.1 11.68,13.21 15.49,9.4 RST.A' | RST.A' 15.75,9.4 15.75,12.45 IC3.33 16,12.7 17.02,13.72 18.29,13.72 18.8,13.21 19.05,13.21 IC3.35 | C9.2 6.6,2.79 6.6,2.54 7.37,1.78 9.65,1.78 10.92,0.51 13.72,0.51 15.49,2.29 RST.A 15.75,2.29 16,2.03 18.8,2.03 | 18.8,2.03 NKA.8 18.8,5.84 15.75,8.89 15.75,9.14 RST.A' | 18.8,2.03 NKA1.8 18.8,1.78 20.07,0.51 29.97,0.51 31.5,2.03 NKA1.3 | EEPRM.4 28.7,62.99 28.7,64.01 EEPRM.3 28.7,64.26 28.7,65.28 EEPRM.2 28.7,65.53 | 28.7,65.53 28.7,66.55 EEPRM.1 | 28.7,65.53 33.78,65.53 EEPRM.7 34.04,65.28 35.56,65.28 37.34,63.5 43.94,63.5 44.45,62.99 45.97,62.99 49.53,59.44 49.53,58.17 50.29,57.4 B2.2 50.55,57.15 52.32,55.37 52.32,52.83 50.55,51.05 50.55,46.48 B3.2 | 19.05,35.81 19.05,36.83 16.26,39.62 WS10.S 16.26,39.88 14.48,39.88 9.65,44.7 | 19.05,35.81 19.05,34.04 WS1.S | 23.88,31.5 22.86,32.51 22.35,32.51 19.05,35.81 | 23.88,31.5 24.64,30.73 24.89,30.73 WS2.S | LUXNIR.VSS 22.61,44.45 21.08,44.45 20.57,44.96 19.81,44.96 19.56,45.21 18.54,45.21 17.78,45.97 WS9.S 17.53,45.97 15.49,45.97 13.97,44.45 13.72,44.7 9.65,44.7
  Top 0.152: 9.65,44.7 8.38,43.43 7.87,43.94 JST.2 | 17.78,61.21 17.78,60.2 20.32,57.66 21.34,57.66 Q4.2 | B1.2 17.78,61.21 | 22.35,64.26 22.35,66.29 C1.2 | 22.35,64.26 22.35,62.99 RC.1 22.61,62.99 22.61,61.98 26.92,57.66 IC2.2 26.92,53.34 27.94,52.32 | 27.94,52.32 28.7,51.56 WS7.S 28.96,51.31 29.21,51.31 30.99,49.53 31.5,49.53 34.8,46.23 | 27.94,52.32 26.16,50.55 22.61,50.55 WS8.S | LUXRGB1.3 29.72,44.2 26.67,41.15 27.18,40.64 27.18,40.13 27.69,39.62 C14.2 27.94,39.62 | 27.94,39.62 27.94,36.32 C4.2 28.19,36.32 29.72,34.8 29.72,33.78 31.24,32.26 31.24,31.5 WS3.S | 41.15,37.34 40.13,37.34 39.88,37.59 38.35,36.07 36.32,36.07 WS4.S | 41.15,37.34 44.45,34.04 X2.GND 44.7,33.78 45.72,33.78 v46.48,33.02 | 37.08,43.18 36.83,42.93 37.34,42.42 WS5.S 37.08,43.18 | 37.08,43.18 37.59,43.69 | 37.59,43.69 v37.85,43.94 | 34.8,46.23 34.8,45.47 37.08,43.18 | 34.8,46.23 34.8,48.01 WS6.S | 41.15,37.34 42.67,38.86 37.85,43.69 37.59,43.69 | v33.53,39.62 27.94,39.62 | 17.78,61.21 19.3,61.21 22.35,64.26 | v24.13,31.75 23.88,31.5
  Bottom 0.152: 40.64,24.64 45.47,24.64 MICROSD.P$2 45.72,24.64 45.72,32.26 v46.48,33.02 | 40.64,24.64 36.32,24.64 MICROSD.GND1 | 40.64,24.64 36.58,20.57 | 36.58,20.57 36.07,20.07 35.56,20.07 MICROSD.6 | 35.81,9.14 35.81,7.62 34.04,5.84 NKA.2 34.04,5.59 31.5,3.05 NKA1.3 | 35.81,9.14 35.81,9.91 MICROSD.GND3 | 35.81,9.14 44.45,9.14 | 44.45,9.14 45.47,9.14 MICROSD.P$1 | 35.81,9.14 MICROSD.GND3 | ISP.6 45.97,3.3 44.45,4.83 44.45,9.14 | 36.58,20.57 41.4,15.75 35.81,10.16 MICROSD.GND3 | v5.59,14.73 v9.65,18.8 14.22,23.37 v14.73,23.37 | LUXNIR1.VSS 39.88,54.86 39.88,55.37 LUXNIR1.ADR 44.45,55.37 44.96,55.88 C5.2 44.96,56.13 49.28,56.13 B2.2 | 8.64,62.99 JP2.9 | 8.64,62.99 12.19,59.44 IRG.1 | 8.64,62.99 8.89,62.99 10.92,65.02 12.19,65.02 12.95,65.79 B1.2 | LUXRGB2.3 42.42,48.77 42.42,48.51 v37.85,43.94 34.54,40.64 | 34.54,40.64 v33.53,39.62 25.65,31.75 v24.13,31.75 | 34.54,40.64 36.58,40.64 40.39,44.45 41.66,44.45 43.18,45.97 48.51,45.97 48.77,46.23 50.29,46.23 B3.2
MISO  (via drill 0.33)
  Top 0.152: v18.03,27.18 18.54,26.67 IC3.11 | v33.78,21.34 v30.99,24.13 | ISP.1 40.89,5.59 v31.24,15.24
  Bottom 0.152: v18.03,27.18 20.32,27.18 21.34,28.19 26.16,28.19 26.42,28.45 27.18,28.45 31.24,24.38 v30.99,24.13 | MICROSD.7 35.31,21.34 v33.78,21.34 31.24,18.8 v31.24,15.24
MOSI  (via drill 0.33)
  Top 0.152: v17.78,25.4 18.54,25.4 19.05,25.91 IC3.10 | v26.67,27.69 26.67,26.67 34.29,19.05 34.29,18.54 36.58,16.26 | 36.58,16.26 46.99,5.84 46.99,2.03 45.47,0.51 ISP.4 | 36.58,16.26 v36.83,16.51
  Bottom 0.152: v17.78,25.4 19.05,25.4 21.34,27.69 v26.67,27.69 | v36.83,16.51 35.56,16.51 MICROSD.3
N$1
  Top 0.152: 4.32,36.58 6.86,39.12 7.62,39.12 IC4.3 | 4.32,36.58 7.87,33.02 C2.1 | J2.3 2.03,29.21 1.27,29.97 1.27,30.99 1.02,31.24 1.02,32.26 3.56,34.8 3.56,35.81 4.32,36.58
N$2  (via drill 0.33)
  Top 0.152: C7.1 2.54,17.78 1.52,18.8 1.52,22.35 3.05,23.88 6.35,20.57 | 6.35,20.57 6.6,20.32 X3.P$1 6.35,20.57 | v12.7,25.15 13.46,24.38 13.72,24.38 IC3.16 | 6.35,20.57 v8.38,20.57
  Bottom 0.152: v12.7,25.15 12.7,24.89 v8.38,20.57
N$3  (via drill 0.33)
  Top 0.152: 6.6,16.51 3.56,19.56 3.56,20.32 2.54,21.34 C6.1 | v14.22,22.35 13.21,23.37 13.21,23.62 IC3.17 | 6.6,16.51 v8.38,16.51 | 6.6,16.51 X3.P$2
  Bottom 0.152: v8.38,16.51 v14.22,22.35
N$4  (via drill 0.33)
  Top 0.152: v14.48,38.86 13.46,38.86 WS10.I | v15.24,41.15 16.26,42.16 WS9.O
  Bottom 0.152: v14.48,38.86 14.48,40.39 v15.24,41.15
N$5  (via drill 0.33)
  Top 0.152: v26.16,56.13 26.16,57.15 IC2.1 | CHARGE.C v29.72,59.69
  Bottom 0.152: v29.72,59.69 v26.16,56.13
N$6
  Top 0.152: IC2.5 25.91,60.2 25.91,61.47 24.38,62.99 RC.2
N$7  (via drill 0.33)
  Top 0.152: v23.37,55.37 22.35,55.37 Q4.3 | v35.56,66.8 37.59,66.8 U$1.-
  Bottom 0.152: v23.37,55.37 24.13,55.37 v35.56,66.8
N$9  (via drill 0.33)
  Top 0.152: 19.56,39.12 19.05,39.12 IR5.C | 25.65,33.02 26.42,32.26 IR1.C | 25.65,33.02 19.56,39.12 | v23.37,46.99 22.86,47.5 IR4.C | 19.56,39.12 v19.81,39.37 | v29.72,47.5 29.97,47.24 32.51,47.24 IR3.C | v30.48,37.85 34.8,37.85 IR2.C | 25.65,33.02 v25.91,33.27 | Q1.3 13.72,32.77 v13.46,33.02
  Bottom 0.152: v29.72,47.5 29.72,52.07 28.19,53.59 26.16,51.56 26.16,49.78 v23.37,46.99 23.37,42.93 v19.81,39.37 v13.46,33.02 | v25.91,33.27 v30.48,37.85
N$10
  Top 0.152: CHARGE.A 33.27,59.69 33.27,57.15 33.78,56.64 RE1.1
N$11
  Top 0.152: IR1.A 27.69,32.26 27.69,29.97 27.94,29.72 30.48,29.72 33.02,27.18 33.53,27.18 35.56,29.21 30.99,33.78 IRR1.1
N$12
  Top 0.152: 21.84,5.59 24.64,8.38 T2.1 | 21.84,5.59 21.34,6.1 NKA.7 21.84,5.59 | 21.84,5.59 23.88,3.56 32,3.56 32.26,3.3 34.54,3.3 35.56,2.29 36.58,2.29 NKA1.1
N$13  (via drill 0.33)
  Top 0.152: v32,43.18 35.05,40.13 35.05,39.37 IR2.A | v32.51,44.96 33.27,44.96 33.78,44.45 IRR2.1
  Bottom 0.152: v32,43.18 32,44.45 v32.51,44.96
N$14
  Top 0.152: WS6.O 31.24,50.8 31.24,52.32 28.96,54.61 WS7.I
N$15
  Top 0.152: IR3.A 31.24,48.26 28.7,48.26 27.94,49.02 IRR3.1
N$17  (via drill 0.33)
  Top 0.152: v21.34,45.21 21.34,46.74 IR4.A | v20.83,43.69 20.07,43.69 19.81,43.94 IRR4.1
  Bottom 0.152: v21.34,45.21 21.34,44.2 v20.83,43.69
N$18
  Top 0.152: IR5.A 19.3,37.85 19.3,37.34 21.34,35.31 IRR5.1
N$19  (via drill 0.33)
  Top 0.152: v39.12,39.88 37.59,39.88 WS4.O | v41.15,41.91 41.15,42.67 40.64,43.18 WS5.I
  Bottom 0.152: v41.15,41.91 v39.12,39.88
N$20  (via drill 0.33)
  Top 0.152: v36.32,48.26 36.32,46.23 WS5.O | v37.59,49.53 37.59,50.04 36.83,50.8 WS6.I
  Bottom 0.152: v37.59,49.53 v36.32,48.26
N$21  (via drill 0.33)
  Top 0.152: v17.53,28.7 17.78,28.7 23.11,23.37 23.11,23.11 22.61,22.61 IC3.4 | v38.1,31.75 38.86,32.51 39.37,32 RD+1.2
  Bottom 0.152: v17.53,28.7 17.78,28.7 20.07,30.99 37.34,30.99 v38.1,31.75
N$22  (via drill 0.33)
  Top 0.152: v27.43,21.59 26.67,22.35 23.88,22.35 23.62,22.61 23.11,22.1 IC3.3 | v38.1,29.21 38.61,29.21 39.88,27.94 RD-1.2
  Bottom 0.152: v27.43,21.59 30.48,21.59 v38.1,29.21
N$23
  Top 0.152: WS2.I 24.89,27.43 24.89,28.7 22.35,31.24 WS1.O
N$24
  Top 0.152: WS2.O 28.96,30.48 30.48,30.48 30.99,29.97 32,29.97 33.27,28.7 WS3.I
N$25
  Top 0.152: WS3.O 34.8,34.04 38.35,34.04 39.12,34.8 WS4.I
N$27
  Top 0.152: WS9.I 14.73,47.24 17.27,49.78 19.05,48.01 WS8.O
N$28
  Top 0.152: WS8.I 20.57,53.34 23.11,53.34 24.89,51.56 WS7.O
N$31
  Top 0.152: T1.1 21.08,10.41 21.08,7.87 19.81,6.6 20.07,6.35 20.07,3.56 21.34,2.29 NKA1.7
  Bottom 0.152: NKA.6 23.88,4.83 21.34,2.29 NKA1.7
RESET  (via drill 0.33)
  Top 0.152: v19.05,22.61 15.75,25.91 15.49,25.91 IC3.13 | v11.94,11.43 11.94,9.4 RST.B' 11.68,9.14 11.68,2.54 RST.B | ISP.5 45.72,5.08 30.73,20.07 30.73,20.32 v26.42,24.64
  Bottom 0.152: 19.05,20.83 19.05,18.54 v11.94,11.43 | 19.05,20.83 v19.05,22.61 | v26.42,24.64 22.86,24.64 19.05,20.83
RXD  (via drill 0.33)
  Top 0.152: v4.57,35.31 5.84,34.04 5.84,27.18 6.6,26.42 6.6,25.65 6.86,25.4 7.11,25.4 10.16,22.35 10.67,22.35 10.92,22.1 11.43,22.1 IC3.20
  Bottom 0.152: v4.57,35.31 4.57,51.56 JP2.2
SCK  (via drill 0.33)
  Top 0.152: v18.54,24.64 18.8,24.38 19.56,25.15 IC3.9 | v29.21,23.11 v33.27,19.05 43.43,8.89 v43.43,8.38
  Bottom 0.152: v18.54,24.64 18.8,24.64 21.34,27.18 25.15,27.18 v29.21,23.11 | v33.27,19.05 35.31,19.05 MICROSD.5 | v43.43,8.38 ISP.3
SCL  (via drill 0.33)
  Top 0.152: v42.93,47.75 42.93,51.31 42.67,51.56 42.67,52.07 39.12,55.63 | 39.12,55.63 32.51,62.23 32.51,63.5 33.53,64.52 33.78,64.26 EEPRM.6 | RIR3.1 9.4,67.06 v9.4,60.96 11.94,60.96 15.75,57.15 15.75,55.88 17.53,54.1 17.53,53.59 22.35,48.77 24.38,48.77 25.15,48.01 26.42,48.01 28.96,45.47 v29.21,45.47 29.46,45.21 29.97,45.21 30.23,44.96 LUXRGB1.2 | v23.88,40.89 22.86,41.91 22.86,42.42 LUXNIR.CLK | v9.91,26.16 12.45,23.62 12.45,23.11 IC3.18 | v37.34,53.85 39.12,55.63
  Bottom 0.152: v42.93,47.75 LUXRGB2.2 | v9.4,60.96 IRL.1 8.13,55.37 JP2.3 | LUXNIR1.CLK 38.1,54.61 v37.34,53.85 29.21,45.72 v29.21,45.47 24.64,40.89 v23.88,40.89 9.91,26.92 v9.91,26.16
SDA  (via drill 0.33)
  Top 0.152: EEPRM.5 34.04,62.74 36.07,60.71 v36.07,59.69 36.07,59.18 v43.43,51.82 | v22.35,58.67 21.84,59.18 21.84,59.94 RIR4.1 | v31.5,42.42 30.73,42.42 LUXRGB1.6 | v25.4,37.85 24.64,38.61 24.64,41.15 24.13,41.66 24.13,42.42 LUXNIR.DATA | v10.67,24.13 11.94,22.86 11.94,22.61 IC3.19
  Bottom 0.152: LUXNIR1.DATA 38.1,56.13 35.31,58.93 v36.07,59.69 36.07,66.29 36.32,66.55 36.32,67.06 35.31,68.07 31.75,68.07 v22.35,58.67 18.29,58.67 14.99,55.37 13.21,55.37 IRA.1 10.67,52.83 JP2.1 | 43.18,51.56 42.16,51.56 33.02,42.42 v31.5,42.42 26.92,37.85 25.65,37.85 | 43.18,51.56 43.69,51.05 43.43,50.8 LUXRGB2.6 | v10.67,24.13 10.67,26.16 13.46,28.96 15.24,28.96 16,28.19 25.65,37.85 | 25.65,37.85 v25.4,37.85 | 43.18,51.56 v43.43,51.82
TXD  (via drill 0.33)
  Top 0.152: v5.08,26.67 6.86,24.89 7.11,24.89 10.41,21.59 10.67,21.59 IC3.21 | v10.16,38.86 8.89,40.13 7.87,40.13 0.51,47.5 0.51,52.58 JP2.4
  Bottom 0.152: v5.08,26.67 5.08,33.78 v10.16,38.86
VBAT  (via drill 0.33)
  Top 0.152: 27.69,57.91 27.69,57.4 IC2.3 27.69,57.91 | v26.67,58.93 27.69,57.91 | v50.29,26.16 BAT1.P$2 | v50.29,33.78 45.97,38.1 43.94,38.1 39.88,42.16 39.88,42.93 39.62,43.18 39.62,43.69 39.37,43.94 39.37,45.21 38.61,45.97 38.61,46.74 37.08,48.26 37.08,48.51 32.77,52.83 32.51,52.83 30.23,55.12 30.23,55.37 27.69,57.91 | v8.89,44.96 8.13,45.72 7.87,45.72 JST.1
  Bottom 0.152: v26.67,58.93 25.91,58.93 22.61,55.63 22.61,54.1 20.07,51.56 20.07,51.05 11.43,42.42 | 11.43,42.42 10.92,41.91 10.92,40.64 J2.2 | v50.29,33.78 v50.29,26.16 | 11.43,42.42 v8.89,44.96
VBUS  (via drill 0.33)
  Top 0.152: 24.38,66.29 24.38,64.77 25.4,63.75 25.4,62.48 27.69,60.2 IC2.4 27.94,59.94 28.45,59.94 31.75,56.64 RE1.2 32.26,56.64 32.26,56.39 33.02,55.63 34.04,55.63 v46.48,43.18 | JP2.5 5.84,58.67 4.57,59.94 4.57,65.79 6.86,68.07 22.61,68.07 24.38,66.29 | 24.38,66.29 C1.1 | v19.81,23.37 20.57,24.13 IC3.7 | v23.11,25.4 24.64,25.4 v29.97,20.07 31.24,18.8 31.24,16.26 41.91,5.59 41.91,3.56 ISP.2 | v40.39,30.48 44.45,30.48 X2.VBUS
  Bottom 0.152: v19.81,23.37 21.08,23.37 v23.11,25.4 | v29.97,20.07 v40.39,30.48 40.64,30.73 41.15,30.73 52.32,41.91 51.05,43.18 v46.48,43.18
VCC  (via drill 0.33)
  Top 0.152: 23.37,19.05 22.61,18.29 22.61,18.03 22.86,17.78 22.86,17.27 IC3.42 23.11,17.02 23.37,17.02 v24.64,15.75 | 23.37,19.05 24.13,18.29 IC3.44 | IC3.6 20.07,22.35 20.57,21.84 | 23.37,19.05 20.57,21.84 | 20.57,21.84 18.8,21.84 v17.02,23.62 15.49,25.15 14.99,25.15 IC3.14 | WS1.D 20.32,28.7 20.32,29.46 14.73,35.05 WS10.D 14.48,35.05 13.46,35.05 v13.21,35.31 | v8.38,35.05 8.38,36.83 IC4.2 | C9.1 8.13,2.79 8.13,4.83 7.62,5.33 7.62,6.6 3.56,10.67 THM1.2 | v11.94,18.8 10.92,17.78 IC3.24 | C3.1 7.87,25.65 v8.38,25.15 | 26.16,37.08 26.16,39.62 C14.1 25.91,39.62 25.15,40.39 25.15,41.15 24.64,41.66 24.64,43.43 24.13,43.94 24.13,44.2 LUXNIR.VDD 23.88,44.2 23.37,44.2 LUXNIR.ADR 23.37,45.97 17.02,52.32 | 26.16,37.08 26.16,36.32 C4.1 26.42,36.32 26.42,33.78 26.67,33.53 26.67,33.02 26.92,32.77 26.92,29.21 | 26.16,37.08 25.15,37.08 20.07,42.16 19.05,42.16 IRR4.2 18.8,42.16 15.49,45.47 13.46,43.43 WS9.D | WS7.D 24.89,54.86 24.13,55.63 24.13,58.42 22.86,59.69 22.86,60.71 21.08,62.48 20.07,61.47 20.07,59.94 RIR4.2 19.05,59.94 v18.54,60.45 | JP2.7 7.37,61.98 | 7.37,61.98 7.62,62.23 7.62,67.06 RIR3.2 | 17.02,52.32 17.02,54.1 IRP.1 13.21,57.91 11.43,57.91 7.37,61.98 | 17.02,52.32 17.02,51.05 WS8.D | 41.4,44.96 39.37,46.99 WS5.D 39.12,46.99 33.53,52.58 33.53,53.34 WS6.D | 41.4,44.96 43.43,42.93 43.43,41.91 44.2,41.15 44.45,41.15 RU1.2 | EEPRM.8 34.04,66.55 34.54,66.04 35.31,66.04 37.34,64.01 40.13,66.8 44.45,66.8 U$1.+ 44.7,66.8 v44.7,63.75 | v41.4,45.21 41.4,44.96 | 31.5,44.2 32.26,44.2 33.27,43.18 34.04,43.18 34.54,42.67 IRR2.2 34.8,42.42 36.07,41.15 | 31.5,44.2 30.73,44.2 LUXRGB1.1
  Top 0.152: 31.5,44.2 27.69,48.01 26.92,48.01 26.16,48.77 26.16,49.02 IRR3.2 | 36.58,38.35 36.07,38.86 36.07,41.15 | 36.58,38.35 38.35,36.58 40.39,38.61 WS4.D | 36.58,38.35 33.53,35.31 32.77,35.31 IRR1.2 32.77,35.05 32.77,33.78 34.04,32.51 35.31,32.51 36.58,31.24 WS3.D 36.58,30.99 36.58,19.56 | 24.13,10.16 22.35,8.38 T1.2 | 24.13,10.16 23.88,10.41 T2.2 23.62,10.41 21.84,12.19 19.3,12.19 19.05,12.45 18.8,12.45 IC3.34 | 26.92,29.21 28.7,27.43 WS2.D 28.96,27.18 36.58,19.56 | 26.92,29.21 26.42,29.72 26.42,31.24 26.16,31.5 25.65,31.5 23.37,33.78 IRR5.2 | v50.8,9.14 46.99,9.14 v37.34,18.8 36.58,19.56 | v24.64,10.16 24.13,10.16 | 36.07,41.15 v36.32,41.4
  Bottom 0.152: v13.21,35.31 8.64,35.31 v8.38,35.05 v8.38,25.15 8.38,22.1 7.11,20.83 7.11,18.54 6.86,18.29 6.86,17.02 4.83,14.99 4.83,12.19 3.56,10.92 THM1.2 3.56,10.67 11.68,18.8 v11.94,18.8 16.76,23.62 v17.02,23.62 | v18.54,60.45 18.29,60.45 IRP.1 | 45.21,49.02 46.99,49.02 47.24,49.28 48.77,49.28 51.82,52.32 51.82,53.59 50.04,55.37 | 45.21,49.02 43.43,49.02 LUXRGB2.1 | 50.04,55.37 49.53,55.88 49.28,55.63 46.48,55.63 44.96,54.1 C5.1 | 47.24,60.2 43.18,56.13 40.13,56.13 LUXNIR1.VDD | 47.24,60.2 49.53,60.2 52.32,57.4 50.29,55.37 50.04,55.37 | v44.7,63.75 47.75,60.71 47.24,60.2 | 45.21,49.02 v41.4,45.21 40.13,45.21 v36.32,41.4 | v50.8,9.14 50.8,7.87 RSD.2 | v37.34,18.8 36.58,18.03 35.56,18.03 MICROSD.4 35.31,17.78 35.05,17.53 34.54,17.53 27.18,10.16 v24.64,10.16 v24.64,15.75

### Text on the board
tNames: PUBLIC | LAB | ***** | OPEN- | LUX | **** | REV-O | RGB | LUXNIR | USB
bNames: A2 | GND | A1 | VCC | VBUS | A0 | LUXNIR | TX | SCL | RX | SDA | PUBLICLAB.ORG/WIKI/OPEN-LUX | RGB | CERN Open | Hardware License | Ver. 1.1 | A4 | LCD | LED | GND | LED | D8 | D9 | A3 | GND | MISO | SCK | GND | LCD | D8 | D9 | A3 | GND | A4 | VBUS | MOSI | RST | GND